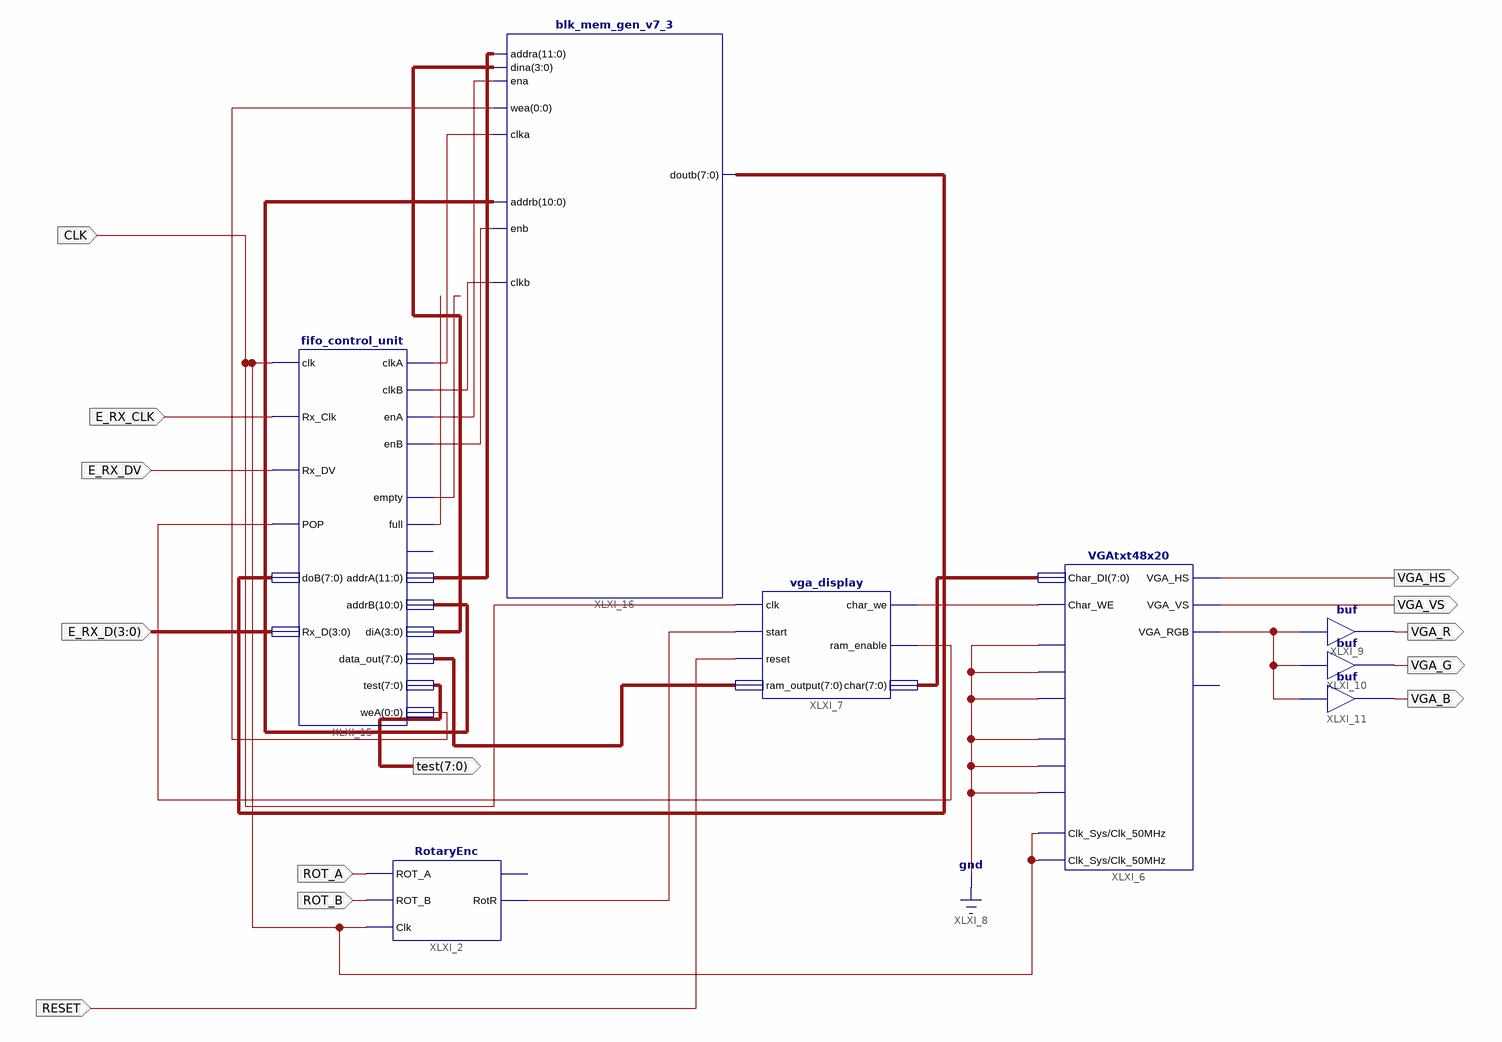
[diagram p0: schematic sheet 1]
// Xilinx ISE schematic MII_schem.sch (spartan3e) as structural Verilog: 8 symbols, 13 ports
module MII_schem (
  input  E_RX_CLK,
  input  [3:0] E_RX_D,
  input  ROT_A,
  input  ROT_B,
  input  RESET,
  input  E_RX_DV,
  input  CLK,
  output VGA_HS,
  output VGA_VS,
  output VGA_R,
  output VGA_G,
  output VGA_B,
  output [7:0] test
);

  wire EMPTY, FULL, XLXN_21, XLXN_26, XLXN_28, XLXN_35, XLXN_56, XLXN_57, XLXN_58, XLXN_59;
  wire [0:0] XLXN_62;
  wire [3:0] XLXN_63;
  wire [7:0] XLXN_29, XLXN_36, XLXN_65;
  wire [10:0] XLXN_61;
  wire [11:0] XLXN_60;

  RotaryEnc XLXI_2 (.ROT_A(ROT_A), .ROT_B(ROT_B), .RotR(XLXN_21), .Clk(CLK));  // open: RotL
  VGAtxt48x20 XLXI_6 (
    .Char_DI(XLXN_29), .Home(1'b0), .NewLine(1'b0), .Goto00(1'b0), .Clk_Sys(CLK), .Clk_50MHz(CLK),
    .CursorOn(1'b0), .ScrollEn(1'b0), .ScrollClear(1'b0), .VGA_HS(VGA_HS), .VGA_VS(VGA_VS),
    .VGA_RGB(XLXN_35), .Char_WE(XLXN_28));  // open: Busy
  vga_display XLXI_7 (
    .clk(CLK), .start(XLXN_21), .reset(RESET), .ram_output(XLXN_36), .char_we(XLXN_28), .ram_enable(XLXN_26),
    .char(XLXN_29));
  buf XLXI_9 (VGA_R, XLXN_35);
  buf XLXI_10 (VGA_G, XLXN_35);
  buf XLXI_11 (VGA_B, XLXN_35);
  fifo_control_unit XLXI_15 (
    .clk(CLK), .Rx_Clk(E_RX_CLK), .Rx_DV(E_RX_DV), .POP(XLXN_26), .doB(XLXN_65), .Rx_D(E_RX_D),
    .clkA(XLXN_56), .clkB(XLXN_57), .enA(XLXN_58), .enB(XLXN_59), .empty(EMPTY), .full(FULL),
    .addrA(XLXN_60), .addrB(XLXN_61), .diA(XLXN_63), .data_out(XLXN_36), .test(test), .weA(XLXN_62[0]));  // open: EOF
  blk_mem_gen_v7_3 XLXI_16 (
    .addra(XLXN_60), .dina(XLXN_63), .ena(XLXN_58), .wea(XLXN_62[0]), .clka(XLXN_56), .addrb(XLXN_61),
    .enb(XLXN_59), .clkb(XLXN_57), .doutb(XLXN_65));
endmodule
